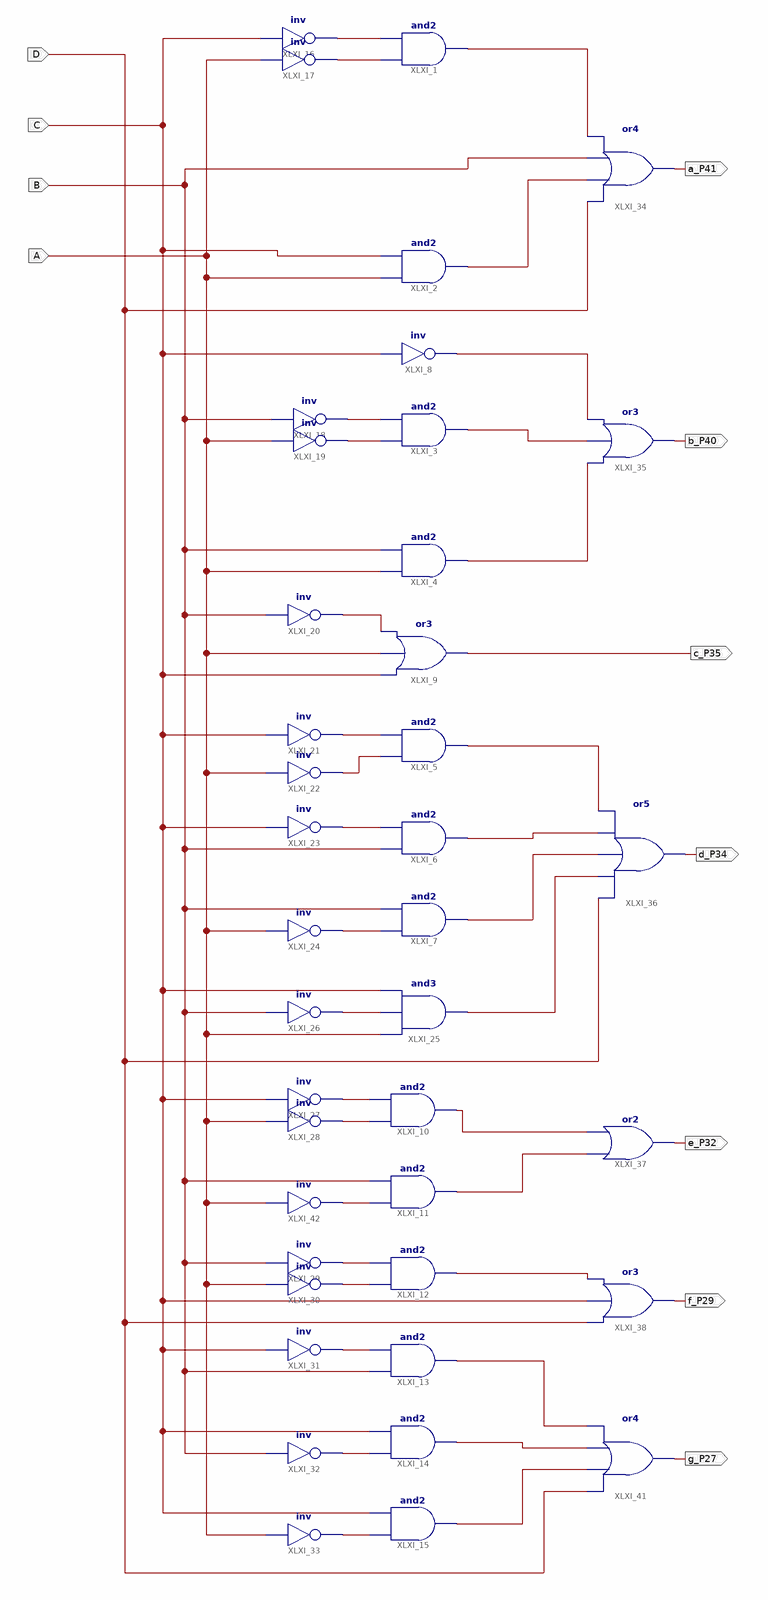
[diagram p0: schematic sheet 1]
// Xilinx ISE schematic BCDtoSeg.sch (spartan6) as structural Verilog: 40 symbols, 11 ports
module BCDtoSeg (
  input  B,
  input  A,
  input  D,
  input  C,
  output a_P41,
  output b_P40,
  output c_P35,
  output d_P34,
  output e_P32,
  output f_P29,
  output g_P27
);

  wire XLXN_4, XLXN_5, XLXN_6, XLXN_7, XLXN_8, XLXN_9, XLXN_10, XLXN_11, XLXN_12, XLXN_13, XLXN_14, XLXN_15,
       XLXN_16, XLXN_17, XLXN_18, XLXN_19, XLXN_20, XLXN_21, XLXN_22, XLXN_23, XLXN_25, XLXN_26, XLXN_27,
       XLXN_28, XLXN_29, XLXN_30, XLXN_32, XLXN_33, XLXN_34, XLXN_35, XLXN_36, XLXN_37, XLXN_38;

  and XLXI_1 (XLXN_22, XLXN_5, XLXN_4);
  and XLXI_2 (XLXN_23, A, C);
  and XLXI_3 (XLXN_26, XLXN_9, XLXN_8);
  and XLXI_4 (XLXN_27, A, B);
  and XLXI_5 (XLXN_28, XLXN_12, XLXN_11);
  and XLXI_6 (XLXN_29, B, XLXN_13);
  and XLXI_7 (XLXN_30, XLXN_14, B);
  not XLXI_8 (XLXN_25, C);
  or XLXI_9 (c_P35, C, A, XLXN_10);
  and XLXI_10 (XLXN_33, XLXN_17, XLXN_16);
  and XLXI_11 (XLXN_34, XLXN_18, B);
  and XLXI_12 (XLXN_35, XLXN_20, XLXN_19);
  and XLXI_13 (XLXN_36, B, XLXN_21);
  and XLXI_14 (XLXN_37, XLXN_7, C);
  and XLXI_15 (XLXN_38, XLXN_6, C);
  not XLXI_16 (XLXN_4, C);
  not XLXI_17 (XLXN_5, A);
  not XLXI_18 (XLXN_8, B);
  not XLXI_19 (XLXN_9, A);
  not XLXI_20 (XLXN_10, B);
  not XLXI_21 (XLXN_11, C);
  not XLXI_22 (XLXN_12, A);
  not XLXI_23 (XLXN_13, C);
  not XLXI_24 (XLXN_14, A);
  and XLXI_25 (XLXN_32, A, XLXN_15, C);
  not XLXI_26 (XLXN_15, B);
  not XLXI_27 (XLXN_16, C);
  not XLXI_28 (XLXN_17, A);
  not XLXI_29 (XLXN_19, B);
  not XLXI_30 (XLXN_20, A);
  not XLXI_31 (XLXN_21, C);
  not XLXI_32 (XLXN_7, B);
  not XLXI_33 (XLXN_6, A);
  or XLXI_34 (a_P41, D, XLXN_23, B, XLXN_22);
  or XLXI_35 (b_P40, XLXN_27, XLXN_26, XLXN_25);
  or XLXI_36 (d_P34, D, XLXN_32, XLXN_30, XLXN_29, XLXN_28);
  or XLXI_37 (e_P32, XLXN_34, XLXN_33);
  or XLXI_38 (f_P29, D, C, XLXN_35);
  or XLXI_41 (g_P27, D, XLXN_38, XLXN_37, XLXN_36);
  not XLXI_42 (XLXN_18, A);
endmodule
